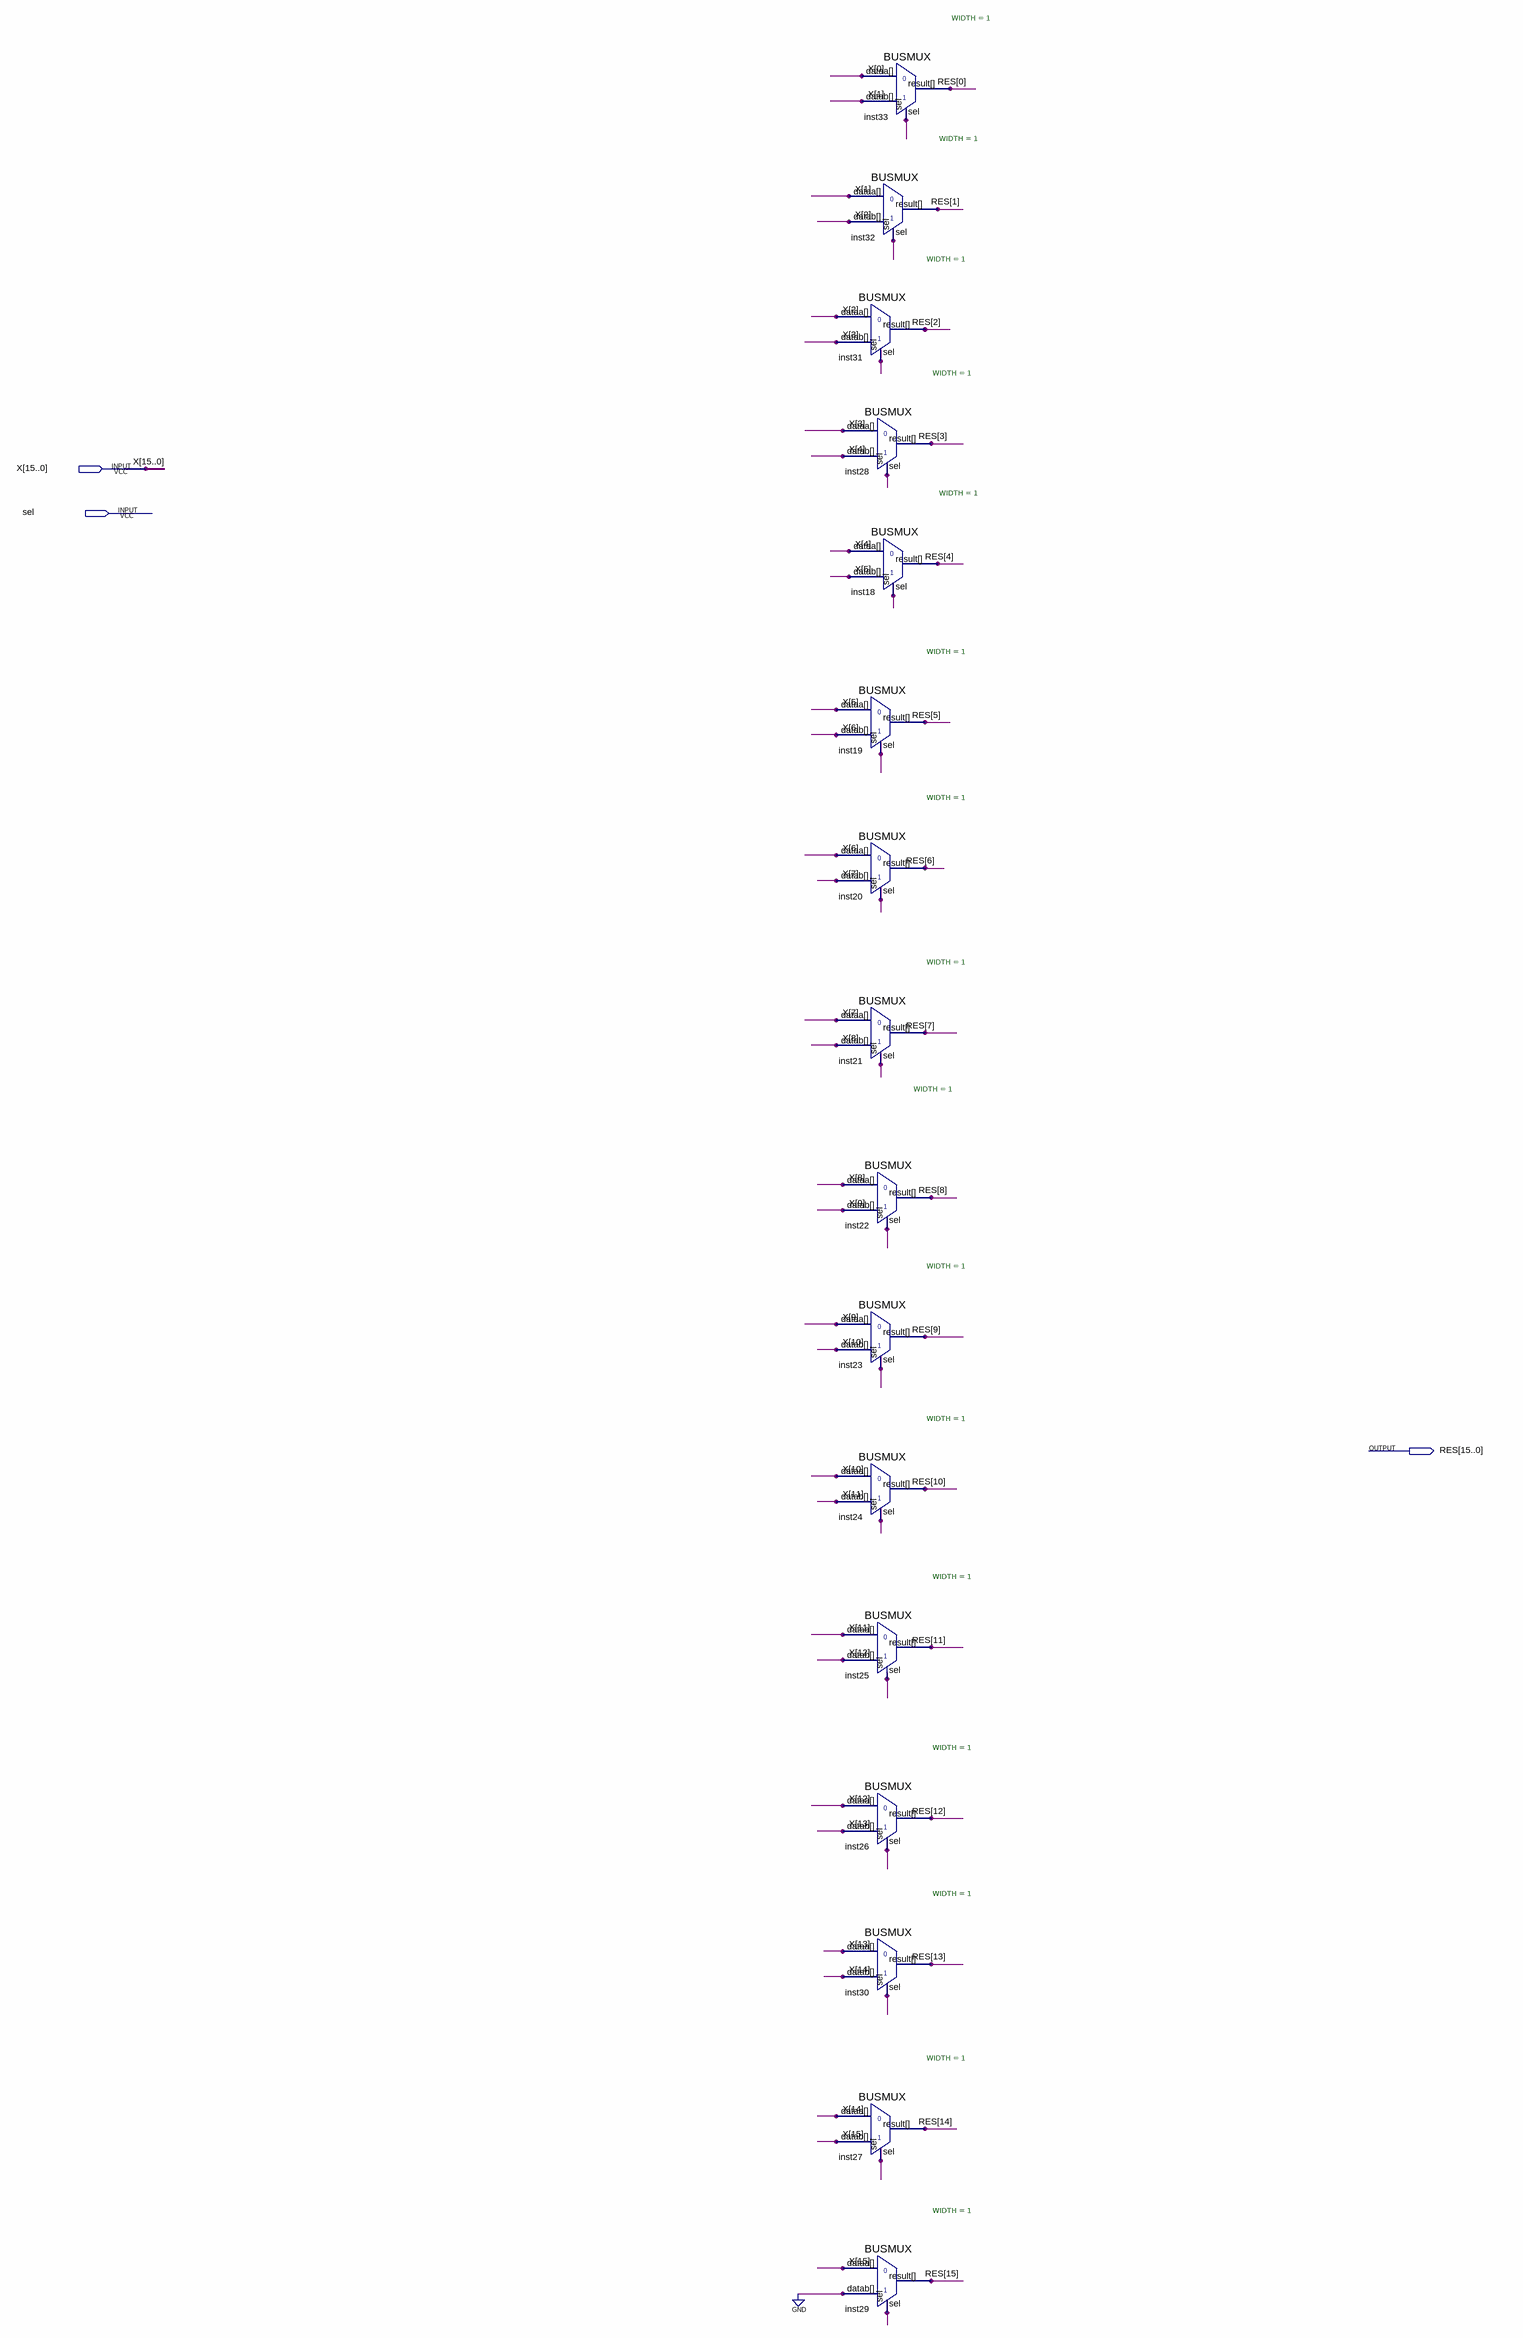
[diagram p0: schematic sheet]
// Quartus schematic barrel_shift_level_1.bdf as structural Verilog: 16 symbols, 3 pins
module barrel_shift_level_1 (
  input  [15:0] X,
  input  sel,
  output [15:0] RES
);

  BUSMUX #(.WIDTH(1)) inst33 (.datab(X[1]), .sel(sel), .dataa(X[0]), .result(RES[0]));
  BUSMUX #(.WIDTH(1)) inst32 (.datab(X[2]), .sel(sel), .dataa(X[1]), .result(RES[1]));
  BUSMUX #(.WIDTH(1)) inst31 (.datab(X[3]), .sel(sel), .dataa(X[2]), .result(RES[2]));
  BUSMUX #(.WIDTH(1)) inst28 (.datab(X[4]), .sel(sel), .dataa(X[3]), .result(RES[3]));
  BUSMUX #(.WIDTH(1)) inst18 (.datab(X[5]), .sel(sel), .dataa(X[4]), .result(RES[4]));
  BUSMUX #(.WIDTH(1)) inst19 (.datab(X[6]), .sel(sel), .dataa(X[5]), .result(RES[5]));
  BUSMUX #(.WIDTH(1)) inst20 (.datab(X[7]), .sel(sel), .dataa(X[6]), .result(RES[6]));
  BUSMUX #(.WIDTH(1)) inst21 (.datab(X[8]), .sel(sel), .dataa(X[7]), .result(RES[7]));
  BUSMUX #(.WIDTH(1)) inst22 (.datab(X[9]), .sel(sel), .dataa(X[8]), .result(RES[8]));
  BUSMUX #(.WIDTH(1)) inst23 (.datab(X[10]), .sel(sel), .dataa(X[9]), .result(RES[9]));
  BUSMUX #(.WIDTH(1)) inst24 (.datab(X[11]), .sel(sel), .dataa(X[10]), .result(RES[10]));
  BUSMUX #(.WIDTH(1)) inst25 (.datab(X[12]), .sel(sel), .dataa(X[11]), .result(RES[11]));
  BUSMUX #(.WIDTH(1)) inst26 (.datab(X[13]), .sel(sel), .dataa(X[12]), .result(RES[12]));
  BUSMUX #(.WIDTH(1)) inst30 (.datab(X[14]), .sel(sel), .dataa(X[13]), .result(RES[13]));
  BUSMUX #(.WIDTH(1)) inst27 (.datab(X[15]), .sel(sel), .dataa(X[14]), .result(RES[14]));
  BUSMUX #(.WIDTH(1)) inst29 (.datab(1'b0), .sel(sel), .dataa(X[15]), .result(RES[15]));
endmodule
